# EAGLE design DCC-headlight-V2 (EAGLE 7.4.0)
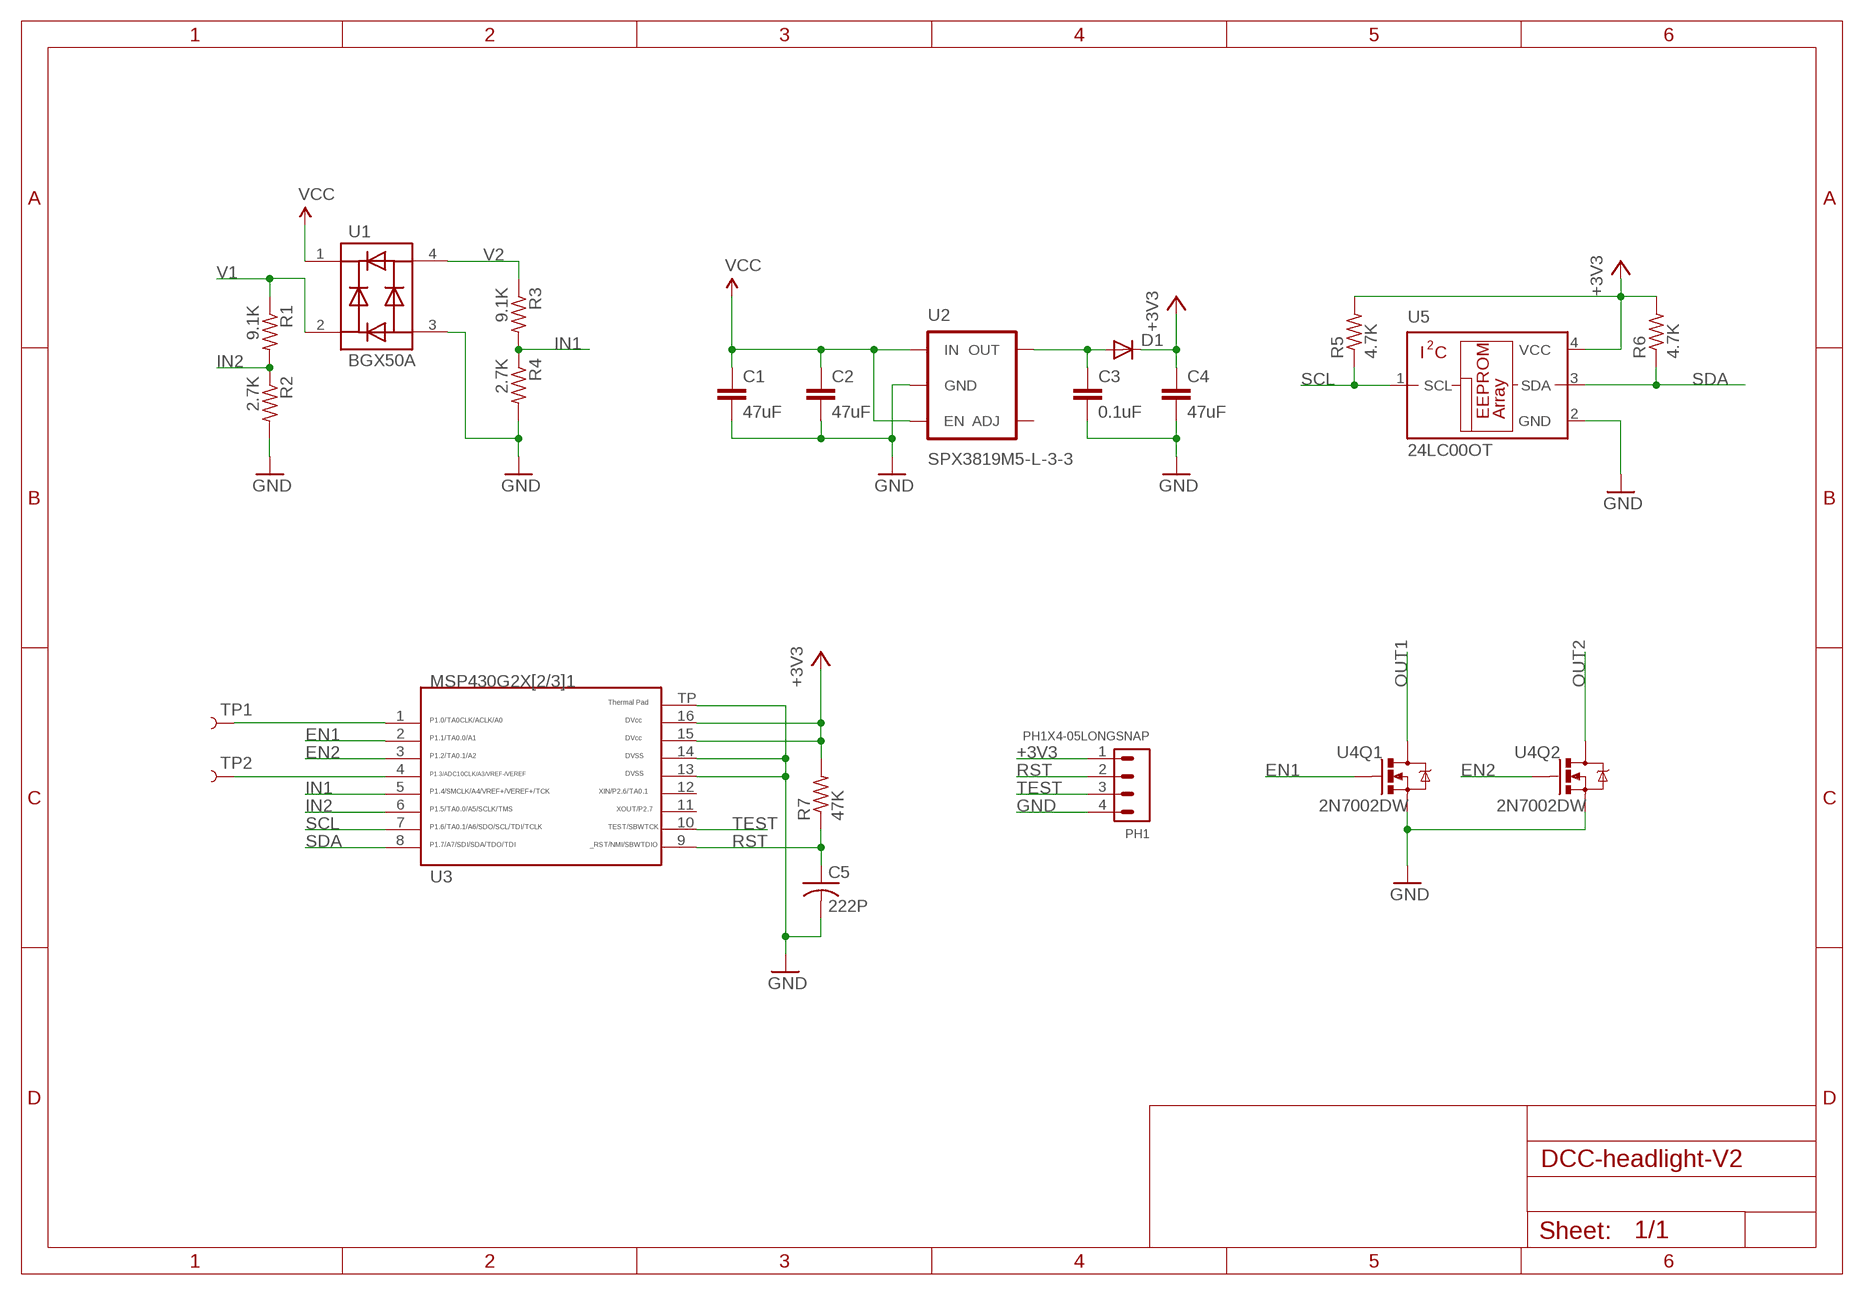
[diagram p0: schematic, sheet 1]

## Parts
C1  47uF  CAP0402-CAP  [0402-CAP]
C2  47uF  CAP0402-CAP  [0402-CAP]
C3  0.1uF  CAP0402-CAP  [0402-CAP]
C4  47uF  CAP0402-CAP  [0402-CAP]
C5  222P  C-USC0402  [C0402]
D1  DIODE-SOD523  [SOD523]
PH1  PH1X4-05LONGSNAP  [PHLS005-1-4]
R1  9.1K  R-US_R0402  [R0402]
R2  2.7K  R-US_R0402  [R0402]
R3  9.1K  R-US_R0402  [R0402]
R4  2.7K  R-US_R0402  [R0402]
R5  4.7K  R-US_R0402  [R0402]
R6  4.7K  R-US_R0402  [R0402]
R7  47K  R-US_R0402  [R0402]
TP1  TEST-POINT3  [PAD.03X.03]
TP2  TEST-POINT3  [PAD.03X.03]
U1  BGX50A  [SOT143]
U2  SPX3819M5-L-3-3  AP2202-ADJ  [SOT23-5]
U3  G2X[2/3]1---RSA16  [RSA16]
U4  2N7002DW  [SOT363]
U5  24LC00OT  [SOT23-5L]

## Nets
+3V3: C4.1 D1.C PH1.1 R5.2 R6.2 R7.2 U3.15 U3.16 U5.4(VCC)
EN1: U3.2 U4.2(Q1:G)
EN2: U3.3 U4.5(Q2:G)
GND: C1.2 C2.2 C3.2 C4.2 C5.2 PH1.4 R2.2 R4.2 U1.3 U2.2(GND) U3.13 U3.14 U3.TP U4.1(Q1:S) U4.4(Q2:S) U5.2(GND)
IN1: R3.2 R4.1 U3.5
IN2: R1.2 R2.1 U3.6
N$1: C3.1 D1.A U2.5(OUT)
OUT1: U4.6(Q1:D)
OUT2: U4.3(Q2:D)
RST: C5.1 PH1.2 R7.1 U3.9
SCL: R5.1 U3.7 U5.1(SCL)
SDA: R6.1 U3.8 U5.3(SDA)
TEST: PH1.3 U3.10
TP1: TP1.P$1 U3.1
TP2: TP2.P$1 U3.4
V1: R1.1 U1.2
V2: R3.1 U1.4
VCC: C1.1 C2.1 U1.1 U2.1(IN) U2.3(EN)
Unconnected: U2.4(ADJ) U3.11 U3.12

## Library data of the parts
C1-C4 = SparkFun-Passives:CAP: Capacitor Standard 0603 ceramic capacitor, and 0.1" leaded capacitor.
C5 = adafruit:C-US: CAPACITOR, American symbol
D1 = RoboJackets-Diodes:DIODE-: DIODE
PH1 = pel_hdr:PH1X4
R1-R7 = rcl:R-US_: RESISTOR, American symbol
TP1 TP2 = SparkFun-Passives:TEST-POINT: Bare copper test points for troubleshooting or ICT
U1 = semicon-smd-ipc:BGX50A
U2 = SparkFun-PowerIC:AP2202-ADJ: AP2202 Adjustable LDO Diodes Inc small, low-cost LDO 150mA, 13.2V, less than 200mV dropout; PROD_ID: VREG-12189; VALUE: AP2202-ADJ
U3 = TI_MSP430_v16:G2X[2/3]1---RSA16: MSP430G2X[2/3]1 QFN (RSA) 16 Pin Package http://focus.ti.com/docs/prod/folders/print/msp430g2221.html
U4 = SparkFun-DiscreteSemi:2N7002DW
U5 = microchip:24*00: Serial EEPROM 128 bit, I2C (AA = 1.8 V/LC = 2.5 V/C = 5.0 V); MF: MICROCHIP; MPN: 24LC00T-I/OT; OC_FARNELL: 9757864; OC_NEWARK: 62K0574

## Board
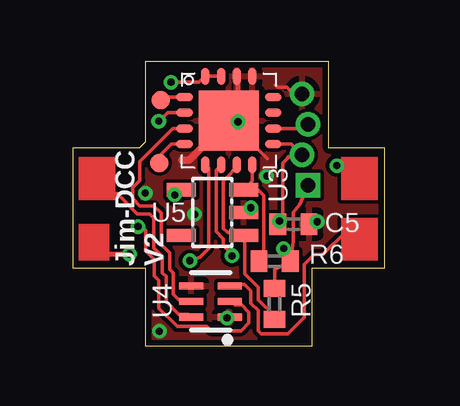
[diagram p1: board, top side]
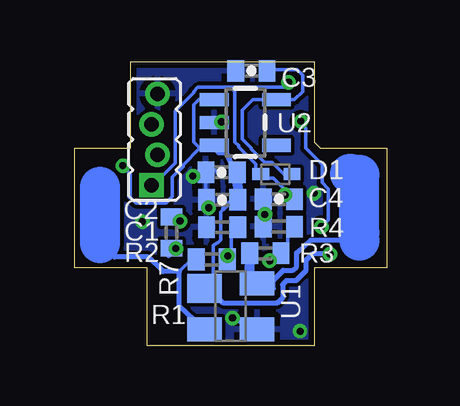
[diagram p2: board, bottom side, seen from below]

Size 13 x 11.86 mm. Coordinates in mm from the lower left corner, seen from the top.
Outline: 3.02,0 9.98,0 9.98,3.25 13,3.25 13,8.25 10.67,8.25 10.67,11.86 3.02,11.86 3.02,8.51 2.77,8.25 0,8.25 0,3.25 3.02,3.25 3.02,0
Copper layers (1*16): Top 0.035mm / dielectric 1.5mm / Bottom 0.035mm
Design rules "6mil": minimum track width 6mil, minimum drill 6mil, track to track 6mil, track to pad 6mil, pad to pad 6mil, via to via 6mil, smd to smd 6mil, copper to edge 10mil, drill to drill 8mil, minimum pad ring 6mil, minimum via ring 6mil, stop-mask expansion 4mil, vias tented up to drill 15mil, thermal gap 10mil

### Footprints (pad centres in the part's own frame; a part is rotated, then mirrored left to right if it is on the bottom)
0402-CAP = smd 0.7 x 0.9: 1 -0.65,0; 2 0.65,0
C0402 = smd 0.7 x 0.9: 1 -0.65,0; 2 0.65,0
SOD523 = smd 0.7 x 0.5: A 0.7,0; C -0.6,0
PHLS005-1-4 = drill 0.6 pad 1.016 square: 1 0,0.127 | drill 0.6 pad 1.016: 2 1.27,-0.127; 3 2.54,0.127; 4 3.81,-0.127
R0402 = smd 0.7 x 0.9: 1 -0.65,0; 2 0.65,0
PAD.03X.03 = smd 0.762 x 0.762: P$1 0,0
SOT143 = smd 1.2 x 1.44: 1 -0.75,-1.1 | smd 1 x 1.44: 2 0.95,-1.1; 3 0.95,1.1; 4 -0.95,1.1
SOT23-5 = smd 0.55 x 1.2: 1 -0.95,-1.3; 2 0,-1.3; 3 0.95,-1.3; 4 0.95,1.3; 5 -0.95,1.3
RSA16 = smd 0.7 x 0.35: 1 -1.85,0.975; 2 -1.85,0.325; 3 -1.85,-0.325; 4 -1.85,-0.975; 9 1.85,-0.975; 10 1.85,-0.325; 11 1.85,0.325; 12 1.85,0.975 | smd 0.35 x 0.7: 5 -0.975,-1.85; 6 -0.325,-1.85; 7 0.325,-1.85; 8 0.975,-1.85; 13 0.975,1.85; 14 0.325,1.85; 15 -0.325,1.85; 16 -0.975,1.85 | smd 2.5 x 2.5: TP 0,0
SOT363 = smd 0.3 x 0.99: 1 -0.65,-0.8; 2 0,-0.8; 3 0.65,-0.8; 4 0.65,0.81; 5 0,0.81; 6 -0.65,0.81
SOT23-5L = smd 0.55 x 1.2: 1 -0.95,-1.3; 2 0,-1.3; 3 0.95,-1.3; 4 0.95,1.3; 5 -0.95,1.3

### Placement (x,y rotation side)
C1  6.86,6.1 180 bottom
C2  6.88,7.24 180 bottom
C3  5.64,11.48 180 bottom
C4  4.5,6.12 180 bottom
C5  9.19,5.08 0 top
D1  4.65,7.16 0 bottom
PH1  9.68,6.71 90 bottom
R1  7.29,3.61 0 bottom
R2  6.86,4.95 180 bottom
R3  5.05,3.86 0 bottom
R4  4.5,4.98 180 bottom
R5  8.41,1.75 90 top
R6  8.41,3.53 0 top
R7  8.97,4.72 270 bottom
TP1  3.66,10.26 0 top
TP2  3.61,7.62 0 top
U1  6.5,1.65 270 bottom
U2  5.89,9.32 270 bottom
U3  6.5,9.4 0 top
U4  5.74,1.85 90 top
U5  5.82,5.56 90 top

### Tracks (layer width: path | path; a pad name or v marks a point on that pad's centre or on a via)
+3V3  (via drill 0.3)
  Top 0.152: PH1.1 9.45,5.89 9.35,5.77 9.2,5.56 9.2,4.33 R6.2 8.41,3.19 R5.2 | U3.15 U3.16 5.25,11 v4.09,11 | U5.4 4.26,6.52 v4.24,6.3
  Top 0.203: R6.2 8.83,3.95 v8.79,4.06
  Bottom 0.152: 5.09,7.01 4.72,7.01 4.27,6.55 4.27,6.54 C4.1 | C4.1 3.73,6.12 | 6.5,10.79 6.33,10.62 6.33,8.51 6.17,8.36 6.17,8.31 5.46,7.6 5.46,7.16 | D1.C 5.46,7.16 | 5.46,7.16 5.54,7.09 | 6.5,10.79 7.87,10.79 8.05,10.62 8.05,10.57 8.81,9.8 8.81,7.62 9.73,6.71 PH1.1 | v4.24,6.3 3.89,5.93 C4.1 | 6.5,10.79 4.19,10.79 v4.09,11
  Bottom 0.203: 5.09,7.01 D1.C | v8.79,4.06 9.09,3.77 R7.2
EN1  (via drill 0.3)
  Top 0.152: U3.2 3.96,9.72 v3.58,9.37 | v2.72,4.98 2.9,4.98 3.05,4.83 3.05,3.96 3.4,3.61 3.4,2.92 3.58,2.74 3.58,1.57 4.34,0.81 5.59,0.81 5.77,0.64 7.01,0.64 7.34,0.96 7.34,1.4 7.04,1.7 6.74,1.7 U4.2
  Bottom 0.152: v3.58,9.37 3.66,9.37 3.38,9.09 3.38,8.25 2.69,7.57 2.69,6.81 2.44,6.55 2.44,5.26 v2.72,4.98
EN2
  Top 0.152: U4.5 4.45,1.91 4.19,2.16 4.19,3.05 4.04,3.2 4.04,3.89 3.68,4.24 3.68,5.54 3.38,5.84 2.79,5.84 2.49,6.15 2.49,6.6 2.79,6.91 2.79,7.7 4.17,9.07 U3.3
GND  (via drill 0.3)
  Top 0.152: C5.2 10.08,5.28 v10.19,5.18 | PH1.4 9.2,10.52 8.91,10.79 8.51,10.79 8.43,10.87 | v6.43,1.17 6.5,1.17 U4.1 | 8.1,7.82 7.54,8.38 7.37,8.38 7.37,8.53 U3.TP
  Top 0.203: v6.88,9.35 6.88,10.91 U3.14
  Top 0.305: 4.55,7.75 4.85,7.75 U3.TP
  Bottom 0.152: 7.53,5.84 C2.2 7.53,7.43 | 7.53,7.43 7.49,7.6 | 7.53,7.43 7.25,7.43 6.96,7.14
  Bottom 0.203: U1.3 5.48,0.7 v6.43,1.17 | U2.2 6.96,9.32 v6.88,9.35
  other vias: 3.61,0.61 3.02,6.38 7.42,5.77 5.08,5.49 8.08,7.09
  pour Bottom: 0,11.68 12.95,11.68 12.95,0 0,0
  pour Top: 0,11.68 12.95,11.68 12.95,0 0,0
IN1  (via drill 0.3)
  Top 0.152: v4.88,3.56 5.28,3.68 5.66,4.06 5.66,7.41 U3.5
  Bottom 0.152: v4.88,3.56 4.5,3.86 R3.2 4.12,4.12 4.12,4.62 3.85,4.89 R4.1
IN2  (via drill 0.3)
  Top 0.152: v6.63,3.76 6.63,3.83 6.27,4.19 6.27,4.47 5.97,4.78 5.97,7.34 U3.6
  Bottom 0.152: R1.2 6.64,3.75 v6.63,3.76 6.48,3.91 6.48,5.21 6.22,4.95 R2.1
  Bottom 0.203: R1.2 6.54,3.52 6.5,3.17
N$1
  Bottom 0.152: D1.A 4.29,7.16 4.78,7.64 5.08,7.64 5.64,8.2 5.64,8.25 6.02,8.64 6.02,9.83 5.58,10.27 U2.5 3.85,10.27 3.5,10.62 3.5,11.3 3.73,11.53 4.94,11.53 C3.1
OUT1
  Top 0.152: 1.27,6.35 1.85,6.35 2.69,5.51 3.2,5.51 3.38,5.33 3.38,4.09 3.73,3.73 3.73,3.05 3.89,2.9 3.89,1.85 4.42,1.32 4.8,1.32 4.87,1.25 U4.6
OUT2
  Top 0.152: 11.43,5.08 11.43,4.83 10.41,3.81 10.06,3.81 9.65,3.4 9.65,1.19 8.97,0.51 7.85,0.51 7.72,0.64 7.72,1.47 7.42,1.78 7.42,2.29 7.14,2.56 6.55,2.56 U4.3
RST  (via drill 0.3)
  Top 0.152: 8.74,5.28 8.64,5 | 8.74,5.28 8.74,7.62 9.02,7.9 8.97,7.87 PH1.2 9.1,8.42 U3.9 | 8.74,5.28 8.74,5.09 C5.1
  Top 0.203: v8.61,5.21 8.8,5.08 C5.1 8.72,5 8.64,5
  Bottom 0.203: R7.1 9.03,5.3 v8.61,5.21
SCL
  Top 0.152: U3.7 6.57,7.18 6.27,6.88 6.27,4.9 6.45,4.72 6.98,4.72 U5.1 7.16,4.54 7.16,3 7.72,2.44 7.72,1.93 8.41,1.25 R5.1
SDA
  Top 0.152: R6.1 7.96,4 7.95,4.57 7.95,6.27 7.75,6.48 7.13,6.48 U5.3 | 7.53,6.58 U5.3 | U3.8 7.48,6.87 U5.3
TEST
  Top 0.152: U3.10 9.38,9.07 PH1.3
TP1
  Top 0.152: U3.1 3.82,10.37 TP1.P$1
TP2
  Top 0.152: TP2.P$1 3.61,7.93 4.11,8.42 U3.4
V1
  Bottom 0.152: R1.1 8.08,3.66 8.64,3.1
  Bottom 0.203: U1.2 8.04,0.7 8.04,1.08 8.64,1.65 8.64,3.1 9.32,3.1 9.93,3.71 11.35,3.71 11.94,4.29 | 8.2,3.45 8.15,3.47 R1.1
  Bottom 1.676: 11.94,4.29 11.94,6.63
V2
  Bottom 0.203: U1.4 4.89,2.6 4.72,2.39 4.72,2.74 4.32,3.15 3.91,3.15 3.76,3.3 3.76,3.89 3.17,4.42 1.4,4.42 1.14,4.72
  Bottom 0.406: R3.1 5.73,2.93 U1.4
  Bottom 1.676: 1.14,4.39 1.14,4.72 1.14,7.14 1.52,7.19
VCC  (via drill 0.3)
  Top 0.203: 1.55,3.83 v2.36,3.83
  Bottom 0.152: 7.66,8.24 7.78,8.24 | U2.1 7.84,10.27 8.05,10.06 8.05,8.51 7.78,8.24 | 6.81,5.71 6.91,5.59 6.91,4.42 7.01,4.32 7.21,4.22 7.24,4.19 7.24,2.87 7.19,2.81 | 10.72,7.16 10.72,7.21 v11,7.52 | 10.72,6.22 10.46,5.97 9.2,5.97 8.94,6.22 8.94,7.04 8.48,7.49 8.48,7.54 7.78,8.24
  Bottom 0.203: 7.66,8.24 U2.3 7,8.05 6.68,8.05 6.38,7.33 C2.1 | 10.72,7.16 10.72,6.22 | C1.1 6.43,6.1 6.81,5.71 | 7.49,2.51 U1.1 7.19,2.81 7.19,2.16 6.83,1.8 4.6,1.8 4.57,1.78 4.34,2.01 4.34,2.56 4.19,2.72 3.79,2.72 3.38,3.12 3.38,3.56 3.1,3.83 v2.36,3.83
  Bottom 0.406: C2.1 C1.1
(copper drawn outside any net)
  shapes: Top area x4

### Text on the board
tPlace: Jim-DCC / V2